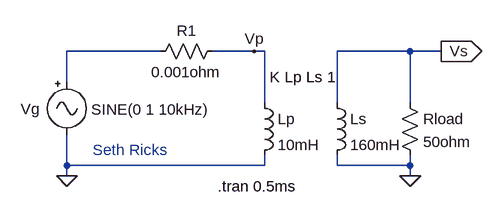
[diagram p0: schematic part1.asc]
part1.asc, the LTspice schematic file:
Version 4.1
SHEET 1 880 680
WIRE 0 208 -144 208
WIRE 144 208 80 208
WIRE 160 208 144 208
WIRE 384 208 272 208
WIRE 432 208 384 208
WIRE -144 256 -144 208
WIRE 160 288 160 208
WIRE 272 288 272 208
WIRE 384 288 384 208
WIRE -144 384 -144 336
WIRE 160 384 160 368
WIRE 160 384 -144 384
WIRE 272 384 272 368
WIRE 384 384 384 368
WIRE 384 384 272 384
WIRE -144 400 -144 384
WIRE 384 400 384 384
FLAG -144 400 0
FLAG 384 400 0
FLAG 432 208 Vs
IOPIN 432 208 Out
FLAG 144 208 Vp
SYMBOL Misc\\signal -144 240 R0
WINDOW 0 -71 57 Left 2
WINDOW 3 37 58 Left 2
SYMATTR InstName Vg
SYMATTR Value SINE(0 1 10kHz)
SYMBOL res 96 192 R90
WINDOW 0 0 56 VBottom 2
WINDOW 3 32 56 VTop 2
SYMATTR InstName R1
SYMATTR Value 0.001ohm
SYMBOL ind 144 272 R0
SYMATTR InstName Lp
SYMATTR Value 10mH
SYMATTR Type ind
SYMBOL ind 256 272 R0
SYMATTR InstName Ls
SYMATTR Value 160mH
SYMATTR Type ind
SYMBOL res 368 272 R0
SYMATTR InstName Rload
SYMATTR Value 50ohm
TEXT 88 416 Left 2 !.tran 0.5ms
TEXT -104 360 Left 2 ;Seth Ricks
TEXT 168 248 Left 2 !K Lp Ls 1

The netlist it stands for:
* part1.asc
Vg N001 0 SINE(0 1 10kHz)
R1 Vp N001 0.001ohm
Lp Vp 0 10mH
Ls Vs 0 160mH
Rload Vs 0 50ohm
.tran 0.5ms
* Seth Ricks
K Lp Ls 1
.backanno
.end

* Results of the author's LTspice run, read from the files saved beside the schematic
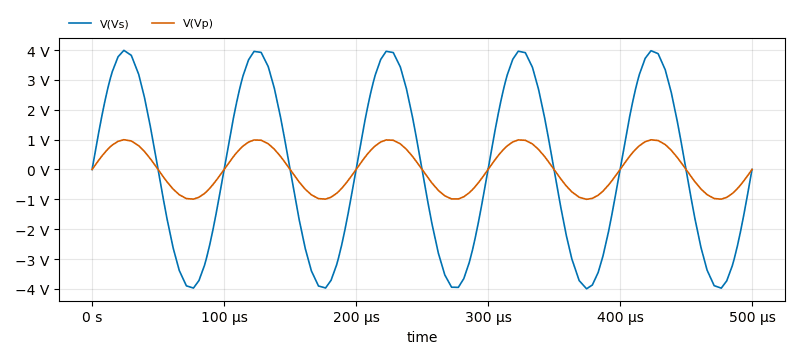
[diagram p1: Transient Analysis of part1.asc, plotted from the saved traces]
* Transient Analysis, 1 run:
*   V(Vs): min -3.997 V, max 3.991 V, average -25.21 µV, rms 2.816 V, last -1.604 µV
*   V(Vp): min -999.2 mV, max 997.8 mV, average -6.307 µV, rms 703.9 mV, last 0 V